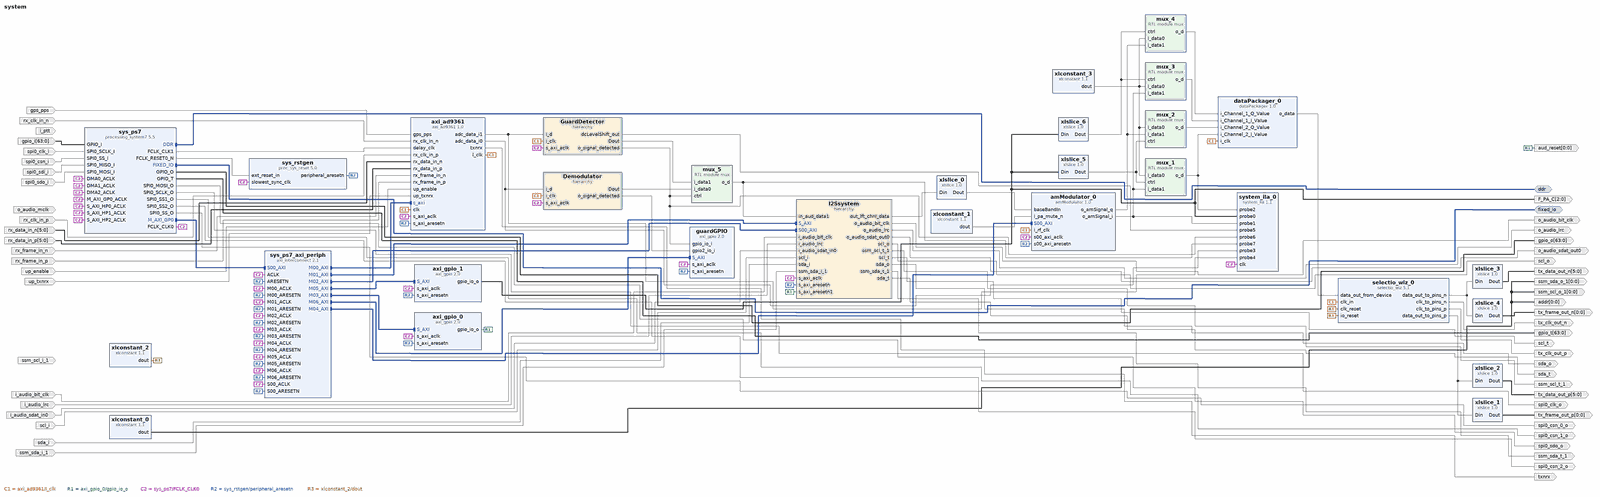
[diagram p0: block diagram of the top level, whole]
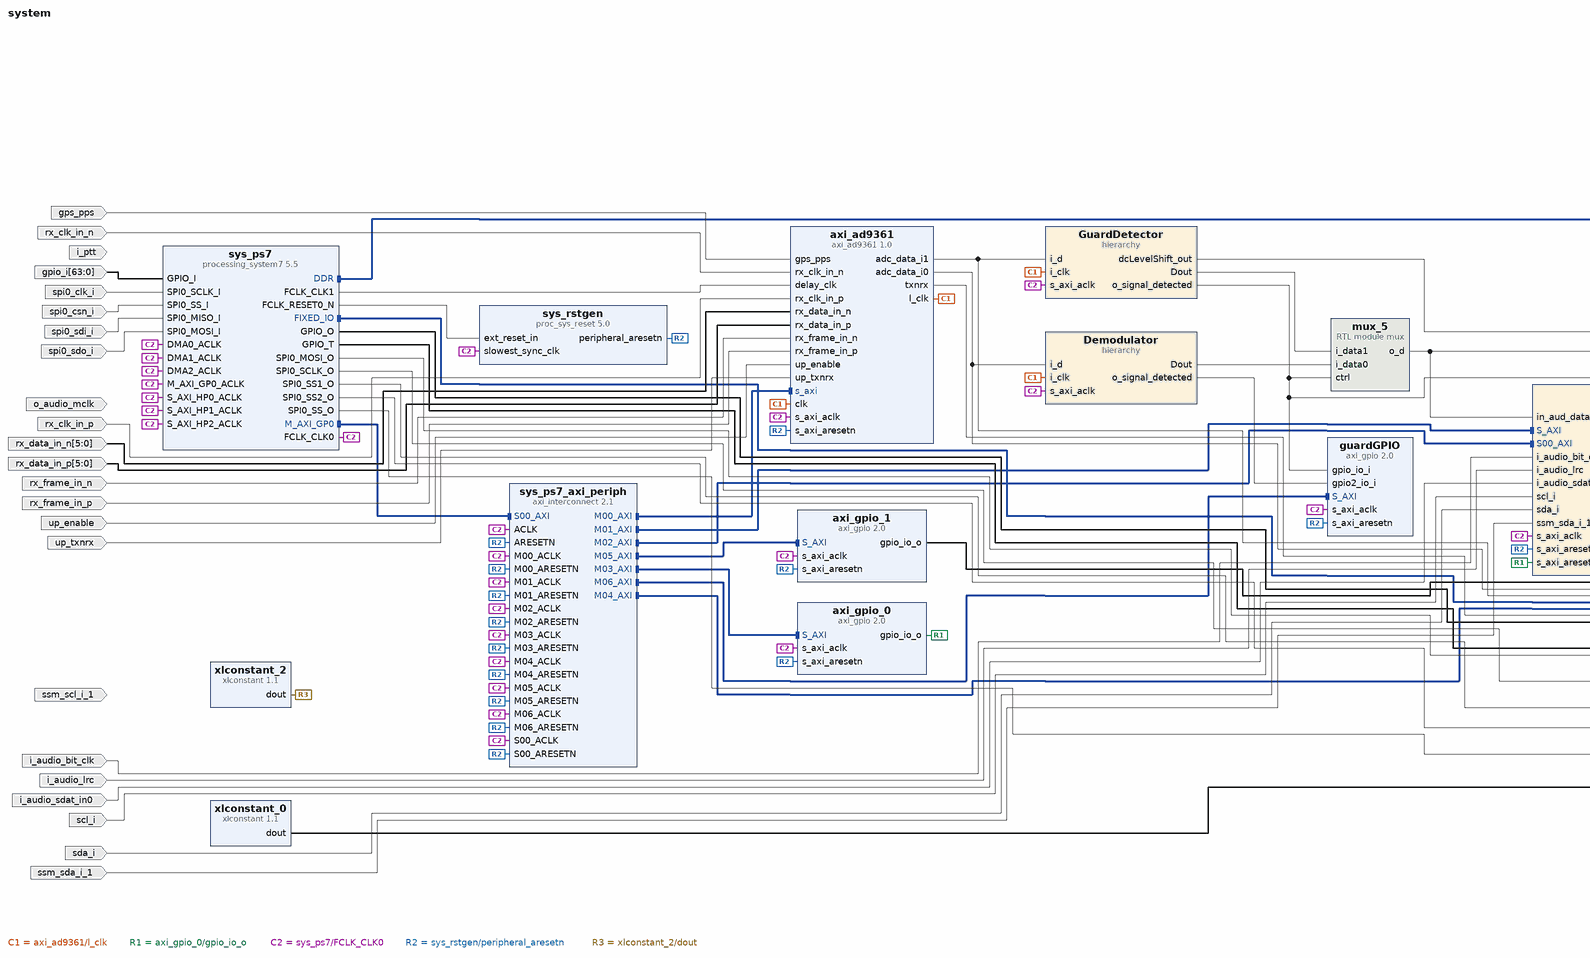
[diagram p1: block diagram of the top level, left part]
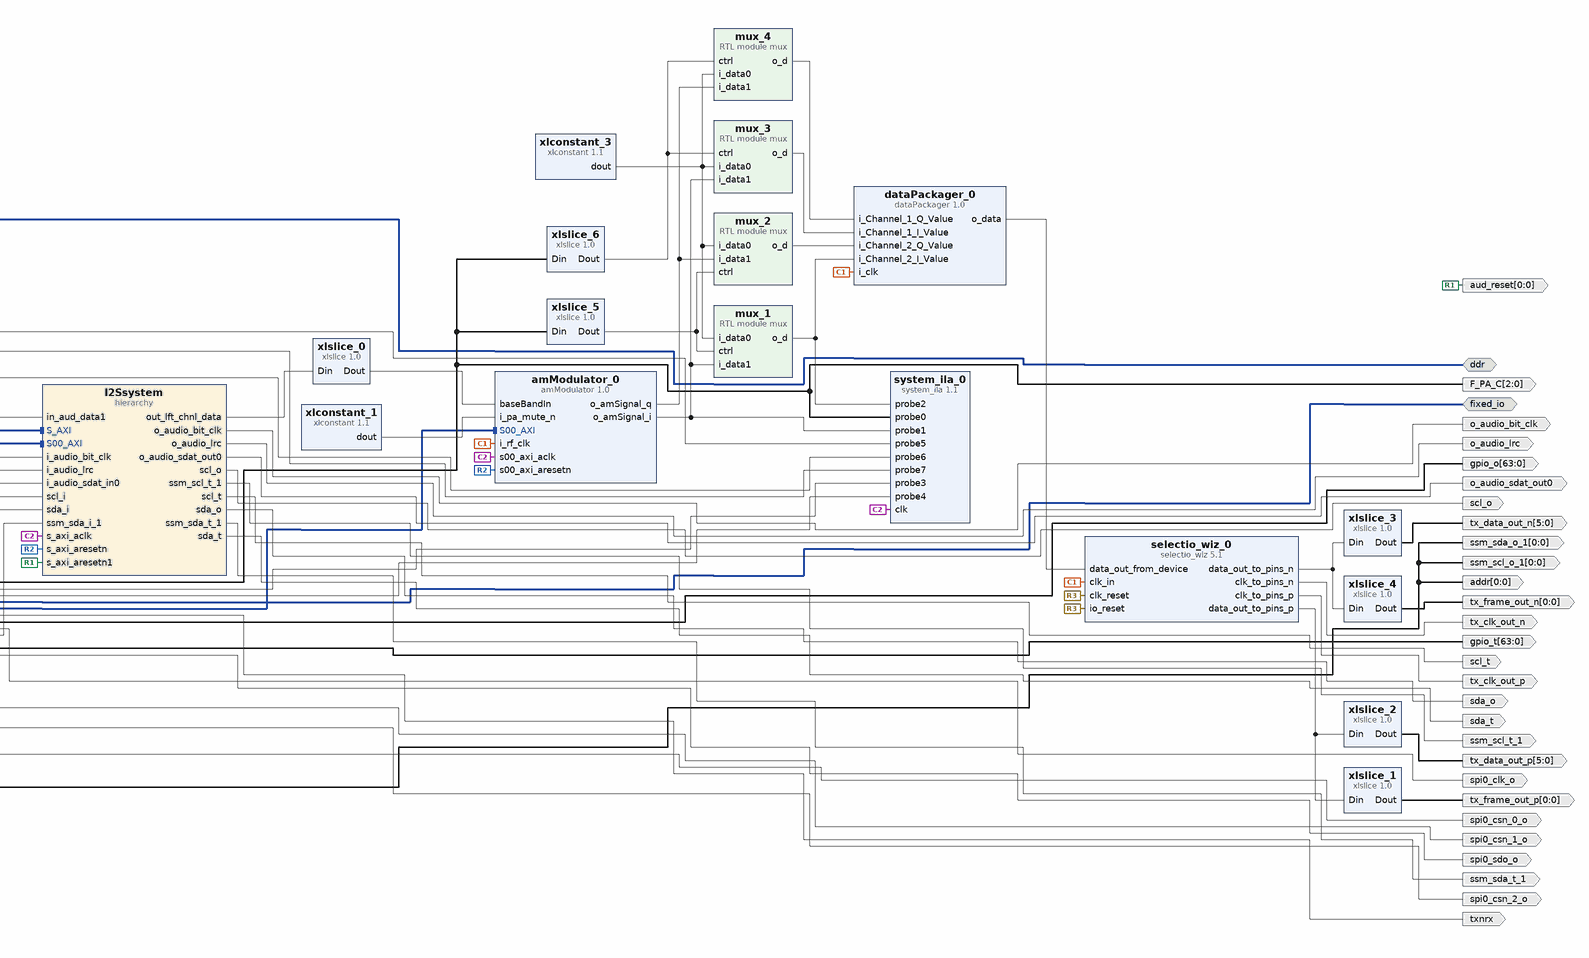
[diagram p2: block diagram of the top level, right part]
# Vivado block design system, xc7z030fbg484-2, Vivado 2021.1
create_bd_design system

create_bd_intf_port -mode Master -vlnv xilinx.com:interface:ddrx_rtl:1.0 ddr
create_bd_intf_port -mode Master -vlnv xilinx.com:display_processing_system7:fixedio_rtl:1.0 fixed_io
create_bd_port -dir O spi0_csn_2_o
create_bd_port -dir O spi0_csn_1_o
create_bd_port -dir O spi0_csn_0_o
create_bd_port -dir I spi0_csn_i
create_bd_port -dir I spi0_clk_i
create_bd_port -dir O spi0_clk_o
create_bd_port -dir I spi0_sdo_i
create_bd_port -dir O spi0_sdo_o
create_bd_port -dir I spi0_sdi_i
create_bd_port -dir I -from 63 -to 0 gpio_i
create_bd_port -dir O -from 63 -to 0 gpio_o
create_bd_port -dir O -from 63 -to 0 gpio_t
create_bd_port -dir O txnrx
create_bd_port -dir I up_enable
create_bd_port -dir I up_txnrx
create_bd_port -dir I gps_pps
create_bd_port -dir I rx_clk_in_p
create_bd_port -dir I rx_clk_in_n
create_bd_port -dir I rx_frame_in_p
create_bd_port -dir I rx_frame_in_n
create_bd_port -dir I -from 5 -to 0 rx_data_in_p
create_bd_port -dir I -from 5 -to 0 rx_data_in_n
create_bd_port -dir O tx_clk_out_p
create_bd_port -dir O tx_clk_out_n
create_bd_port -dir O -from 0 -to 0 tx_frame_out_p
create_bd_port -dir O -from 0 -to 0 tx_frame_out_n
create_bd_port -dir O -from 5 -to 0 tx_data_out_p
create_bd_port -dir O -from 5 -to 0 tx_data_out_n
create_bd_port -dir I scl_i
create_bd_port -dir O scl_o
create_bd_port -dir O scl_t
create_bd_port -dir I sda_i
create_bd_port -dir O sda_o
create_bd_port -dir O sda_t
create_bd_port -dir O -type clk ssm_scl_t_1
create_bd_port -dir O ssm_sda_t_1
create_bd_port -dir O -type clk o_audio_bit_clk
create_bd_port -dir O o_audio_lrc
create_bd_port -dir O o_audio_sdat_out0
create_bd_port -dir I i_audio_sdat_in0
create_bd_port -dir I i_audio_lrc
create_bd_port -dir I -type clk i_audio_bit_clk
set_property -dict {CONFIG.FREQ_HZ 100000000} [get_bd_ports i_audio_bit_clk]
create_bd_port -dir I ssm_sda_i_1
create_bd_port -dir O -from 0 -to 0 ssm_sda_o_1
create_bd_port -dir O -from 0 -to 0 ssm_scl_o_1
create_bd_port -dir O -from 0 -to 0 addr
create_bd_port -dir I o_audio_mclk
create_bd_port -dir I ssm_scl_i_1
create_bd_port -dir O -from 0 -to 0 aud_reset
create_bd_port -dir O -from 2 -to 0 F_PA_C
create_bd_port -dir I i_ptt

create_bd_cell -type ip -vlnv xilinx.com:ip:processing_system7:5.5 sys_ps7
set_property -dict [list \
  CONFIG.PCW_APU_PERIPHERAL_FREQMHZ 666.666666 \
  CONFIG.PCW_CPU_CPU_6X4X_MAX_RANGE 800 \
  CONFIG.PCW_ENET0_PERIPHERAL_ENABLE 0 \
  CONFIG.PCW_ENET1_PERIPHERAL_CLKSRC External \
  CONFIG.PCW_EN_CLK1_PORT 1 \
  CONFIG.PCW_EN_CLK2_PORT 1 \
  CONFIG.PCW_EN_RST1_PORT 1 \
  CONFIG.PCW_EN_RST2_PORT 1 \
  CONFIG.PCW_FCLK_CLK1_BUF TRUE \
  CONFIG.PCW_FCLK_CLK2_BUF TRUE \
  CONFIG.PCW_FPGA0_PERIPHERAL_FREQMHZ 100.0 \
  CONFIG.PCW_FPGA1_PERIPHERAL_FREQMHZ 200.0 \
  CONFIG.PCW_FPGA2_PERIPHERAL_FREQMHZ 200.0 \
  CONFIG.PCW_FPGA_FCLK1_ENABLE 1 \
  CONFIG.PCW_FPGA_FCLK2_ENABLE 1 \
  CONFIG.PCW_GPIO_EMIO_GPIO_ENABLE 1 \
  CONFIG.PCW_GPIO_EMIO_GPIO_IO 64 \
  CONFIG.PCW_GPIO_MIO_GPIO_ENABLE 1 \
  CONFIG.PCW_GPIO_MIO_GPIO_IO MIO \
  CONFIG.PCW_I2C_RESET_ENABLE 0 \
  CONFIG.PCW_IRQ_F2P_INTR 1 \
  CONFIG.PCW_IRQ_F2P_MODE REVERSE \
  CONFIG.PCW_PERIPHERAL_BOARD_PRESET None \
  CONFIG.PCW_PRESET_BANK0_VOLTAGE {LVCMOS 1.8V} \
  CONFIG.PCW_PRESET_BANK1_VOLTAGE {LVCMOS 1.8V} \
  CONFIG.PCW_QSPI_GRP_SINGLE_SS_ENABLE 1 \
  CONFIG.PCW_QSPI_GRP_SINGLE_SS_IO {MIO 1 .. 6} \
  CONFIG.PCW_QSPI_PERIPHERAL_ENABLE 1 \
  CONFIG.PCW_QSPI_QSPI_IO {MIO 1 .. 6} \
  CONFIG.PCW_SD0_PERIPHERAL_ENABLE 0 \
  CONFIG.PCW_SINGLE_QSPI_DATA_MODE x4 \
  CONFIG.PCW_SPI0_PERIPHERAL_ENABLE 1 \
  CONFIG.PCW_SPI0_SPI0_IO EMIO \
  CONFIG.PCW_UART1_PERIPHERAL_ENABLE 0 \
  CONFIG.PCW_UIPARAM_DDR_BUS_WIDTH {16 Bit} \
  CONFIG.PCW_UIPARAM_DDR_FREQ_MHZ 533.333333 \
  CONFIG.PCW_UIPARAM_DDR_PARTNO {MT41K256M16 RE-125} \
  CONFIG.PCW_USB0_PERIPHERAL_ENABLE 0 \
  CONFIG.PCW_USB_RESET_ENABLE 0 \
  CONFIG.PCW_USE_DMA0 1 \
  CONFIG.PCW_USE_DMA1 1 \
  CONFIG.PCW_USE_DMA2 1 \
  CONFIG.PCW_USE_FABRIC_INTERRUPT 1 \
  CONFIG.PCW_USE_S_AXI_HP0 1 \
  CONFIG.PCW_USE_S_AXI_HP1 1 \
  CONFIG.PCW_USE_S_AXI_HP2 1 \
] [get_bd_cells sys_ps7]
# 498 more settings of sys_ps7 are not shown: defaults, MIO pin electricals, DDR timing, and values the tool derives
create_bd_cell -type ip -vlnv xilinx.com:ip:proc_sys_reset:5.0 sys_rstgen
set_property -dict {CONFIG.C_EXT_RST_WIDTH 1} [get_bd_cells sys_rstgen]
create_bd_cell -type ip -vlnv xilinx.com:ip:axi_interconnect:2.1 sys_ps7_axi_periph
set_property -dict {CONFIG.NUM_MI 7} [get_bd_cells sys_ps7_axi_periph]
create_bd_cell -type ip -vlnv xilinx.com:ip:xlconstant:1.1 xlconstant_0
set_property -dict {CONFIG.CONST_VAL 0} [get_bd_cells xlconstant_0]
create_bd_cell -type ip -vlnv xilinx.com:ip:axi_gpio:2.0 axi_gpio_0
set_property -dict {CONFIG.C_ALL_OUTPUTS 1 CONFIG.C_DOUT_DEFAULT 0x00000001 CONFIG.C_GPIO_WIDTH 1} [get_bd_cells axi_gpio_0]
create_bd_cell -type ip -vlnv xilinx.com:ip:xlconstant:1.1 xlconstant_1
create_bd_cell -type ip -vlnv xilinx.com:ip:xlslice:1.0 xlslice_0
set_property -dict {CONFIG.DIN_FROM 29 CONFIG.DIN_TO 18 CONFIG.DIN_WIDTH 31 CONFIG.DOUT_WIDTH 12} [get_bd_cells xlslice_0]
create_bd_cell -type ip -vlnv xilinx.com:ip:selectio_wiz:5.1 selectio_wiz_0
set_property -dict [list \
  CONFIG.BUS_DIR OUTPUTS \
  CONFIG.BUS_IO_STD LVDS \
  CONFIG.BUS_SIG_TYPE DIFF \
  CONFIG.CLK_FWD true \
  CONFIG.CLK_FWD_IO_STD LVDS \
  CONFIG.CLK_FWD_SIG_TYPE DIFF \
  CONFIG.CONFIG_CLK_FWD true \
  CONFIG.SELIO_ACTIVE_EDGE DDR \
  CONFIG.SELIO_BUS_IN_DELAY NONE \
  CONFIG.SELIO_CLK_BUF MMCM \
  CONFIG.SELIO_CLK_IO_STD LVDS \
  CONFIG.SELIO_CLK_SIG_TYPE DIFF \
  CONFIG.SELIO_INTERFACE_TYPE NETWORKING \
  CONFIG.SERIALIZATION_FACTOR 4 \
  CONFIG.SYSTEM_DATA_WIDTH 7 \
] [get_bd_cells selectio_wiz_0]
create_bd_cell -type ip -vlnv xilinx.com:ip:xlconstant:1.1 xlconstant_2
set_property -dict {CONFIG.CONST_VAL 0} [get_bd_cells xlconstant_2]
create_bd_cell -type ip -vlnv xilinx.com:ip:xlslice:1.0 xlslice_1
set_property -dict {CONFIG.DIN_WIDTH 7} [get_bd_cells xlslice_1]
create_bd_cell -type ip -vlnv xilinx.com:ip:xlslice:1.0 xlslice_2
set_property -dict {CONFIG.DIN_FROM 6 CONFIG.DIN_TO 1 CONFIG.DIN_WIDTH 7 CONFIG.DOUT_WIDTH 6} [get_bd_cells xlslice_2]
create_bd_cell -type ip -vlnv xilinx.com:ip:xlslice:1.0 xlslice_3
set_property -dict {CONFIG.DIN_FROM 6 CONFIG.DIN_TO 1 CONFIG.DIN_WIDTH 7 CONFIG.DOUT_WIDTH 6} [get_bd_cells xlslice_3]
create_bd_cell -type ip -vlnv xilinx.com:ip:xlslice:1.0 xlslice_4
set_property -dict {CONFIG.DIN_WIDTH 7} [get_bd_cells xlslice_4]
create_bd_cell -type ip -vlnv xilinx.com:ip:axi_gpio:2.0 axi_gpio_1
set_property -dict {CONFIG.C_ALL_OUTPUTS 1 CONFIG.C_DOUT_DEFAULT 0x00000007 CONFIG.C_GPIO_WIDTH 3} [get_bd_cells axi_gpio_1]
create_bd_cell -type module -reference mux mux_1
create_bd_cell -type module -reference mux mux_2
create_bd_cell -type module -reference mux mux_3
create_bd_cell -type module -reference mux mux_4
create_bd_cell -type ip -vlnv xilinx.com:ip:xlconstant:1.1 xlconstant_3
set_property -dict {CONFIG.CONST_VAL 0 CONFIG.CONST_WIDTH 12} [get_bd_cells xlconstant_3]
create_bd_cell -type ip -vlnv xilinx.com:ip:xlslice:1.0 xlslice_5
set_property -dict {CONFIG.DIN_FROM 2 CONFIG.DIN_TO 2 CONFIG.DIN_WIDTH 3 CONFIG.DOUT_WIDTH 1} [get_bd_cells xlslice_5]
create_bd_cell -type ip -vlnv xilinx.com:ip:xlslice:1.0 xlslice_6
set_property -dict {CONFIG.DIN_FROM 1 CONFIG.DIN_TO 1 CONFIG.DIN_WIDTH 3 CONFIG.DOUT_WIDTH 1} [get_bd_cells xlslice_6]
create_bd_cell -type hier Demodulator
create_bd_cell -type module -reference mux mux_5
create_bd_cell -type hier I2Ssystem
create_bd_cell -type ip -vlnv xilinx.com:ip:system_ila:1.1 system_ila_0
set_property -dict [list \
  CONFIG.C_DATA_DEPTH 65536 \
  CONFIG.C_MON_TYPE NATIVE \
  CONFIG.C_NUM_OF_PROBES 8 \
  CONFIG.C_PROBE0_TYPE 0 \
] [get_bd_cells system_ila_0]
create_bd_cell -type hier GuardDetector
create_bd_cell -type ip -vlnv xilinx.com:ip:axi_gpio:2.0 guardGPIO
set_property -dict [list \
  CONFIG.C_ALL_INPUTS 1 \
  CONFIG.C_ALL_INPUTS_2 1 \
  CONFIG.C_GPIO2_WIDTH 1 \
  CONFIG.C_GPIO_WIDTH 1 \
  CONFIG.C_IS_DUAL 1 \
] [get_bd_cells guardGPIO]
create_bd_cell -type ip -vlnv analog.com:user:axi_ad9361:1.0 axi_ad9361
set_property -dict [list \
  CONFIG.ADC_DATAFORMAT_DISABLE 0 \
  CONFIG.ADC_DATAPATH_DISABLE 0 \
  CONFIG.ADC_DCFILTER_DISABLE 0 \
  CONFIG.ADC_INIT_DELAY 29 \
  CONFIG.ADC_IQCORRECTION_DISABLE 0 \
  CONFIG.ADC_USERPORTS_DISABLE 0 \
  CONFIG.CMOS_OR_LVDS_N 0 \
  CONFIG.DAC_DATAPATH_DISABLE 0 \
  CONFIG.DAC_DDS_DISABLE 0 \
  CONFIG.DAC_IODELAY_ENABLE 1 \
  CONFIG.DAC_IQCORRECTION_DISABLE 0 \
  CONFIG.DAC_USERPORTS_DISABLE 0 \
  CONFIG.DEV_PACKAGE 4 \
  CONFIG.FPGA_FAMILY 4 \
  CONFIG.FPGA_TECHNOLOGY 1 \
  CONFIG.ID 0 \
  CONFIG.MODE_1R1T 0 \
  CONFIG.SPEED_GRADE 21 \
  CONFIG.TDD_DISABLE 0 \
] [get_bd_cells axi_ad9361]
create_bd_cell -type ip -vlnv xilinx.com:user:dataPackager:1.0 dataPackager_0
create_bd_cell -type ip -vlnv xilinx.com:user:amModulator:1.0 amModulator_0

# ---- hierarchy /Demodulator ----
current_bd_instance /Demodulator
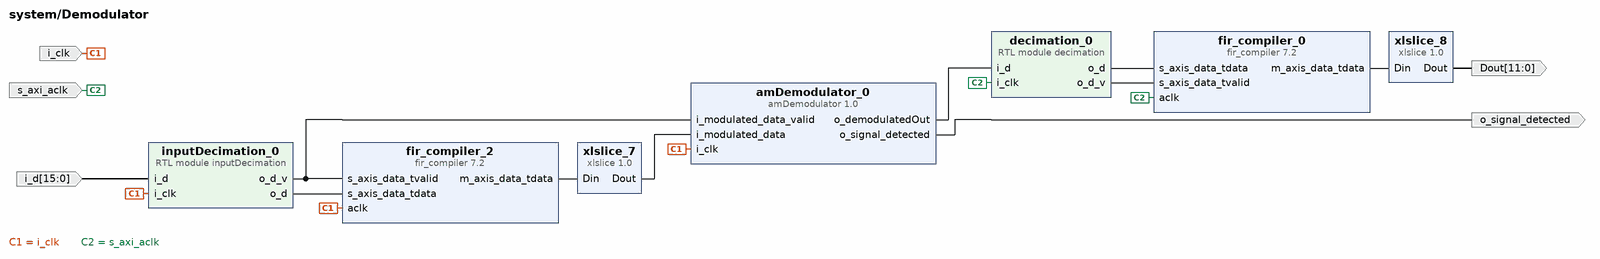
[diagram p3: block diagram inside /Demodulator]
create_bd_pin -dir I -type clk s_axi_aclk
create_bd_pin -dir I -type clk i_clk
create_bd_pin -dir O -from 11 -to 0 Dout
create_bd_pin -dir I -from 15 -to 0 i_d
create_bd_pin -dir O o_signal_detected

create_bd_cell -type ip -vlnv xilinx.com:ip:fir_compiler:7.2 fir_compiler_0
set_property -dict [list \
  CONFIG.BestPrecision true \
  CONFIG.Clock_Frequency 100 \
  CONFIG.CoefficientVector 4.97857463989629e-05,-9.66186716768311e-05,-0.000285972693276480,-0.000638033059764221,-0.00118922643832491,-0.00196250311844038,-0.00295189527080732,-0.00411069959506877,-0.00534467765861517,-0.00651246591908960,-0.00743545387545380,-0.00791730638070645,-0.00777252485882118,-0.00686079086122265,-0.00512249591113992,-0.00260870103501410,0.000500343769484166,0.00389440724056693,0.00715402352601513,0.00979395431763195,0.0113255078683568,0.0113327722797372,0.00955141668320275,0.00593840384848782,0.000720974159454840,-0.00558741726177260,-0.0122098462375855,-0.0181706817624835,-0.0223972169879857,-0.0238486887587461,-0.0216567072141399,-0.0152586643030505,-0.00450455913284762,0.0102798010092384,0.0282855411136966,0.0482744206888967,0.0686901496345555,0.0878159846963768,0.103959968995451,0.115644736336165,0.121777428841651,0.121777428841651,0.115644736336165,0.103959968995451,0.0878159846963768,0.0686901496345555,0.0482744206888967,0.0282855411136966,0.0102798010092384,-0.00450455913284762,-0.0152586643030505,-0.0216567072141399,-0.0238486887587461,-0.0223972169879857,-0.0181706817624835,-0.0122098462375855,-0.00558741726177260,0.000720974159454840,0.00593840384848782,0.00955141668320275,0.0113327722797372,0.0113255078683568,0.00979395431763195,0.00715402352601513,0.00389440724056693,0.000500343769484166,-0.00260870103501410,-0.00512249591113992,-0.00686079086122265,-0.00777252485882118,-0.00791730638070645,-0.00743545387545380,-0.00651246591908960,-0.00534467765861517,-0.00411069959506877,-0.00295189527080732,-0.00196250311844038,-0.00118922643832491,-0.000638033059764221,-0.000285972693276480,-9.66186716768311e-05,4.97857463989629e-05 \
  CONFIG.Coefficient_Fractional_Bits 18 \
  CONFIG.Coefficient_Sets 1 \
  CONFIG.Coefficient_Sign Signed \
  CONFIG.Coefficient_Structure Inferred \
  CONFIG.Coefficient_Width 16 \
  CONFIG.ColumnConfig 1 \
  CONFIG.Data_Fractional_Bits 11 \
  CONFIG.Data_Sign Signed \
  CONFIG.Data_Width 12 \
  CONFIG.Filter_Architecture Systolic_Multiply_Accumulate \
  CONFIG.Output_Rounding_Mode Full_Precision \
  CONFIG.Output_Width 31 \
  CONFIG.Quantization Quantize_Only \
  CONFIG.Sample_Frequency 0.096 \
] [get_bd_cells fir_compiler_0]
create_bd_cell -type module -reference decimation decimation_0
create_bd_cell -type ip -vlnv xilinx.com:ip:xlslice:1.0 xlslice_8
set_property -dict {CONFIG.DIN_FROM 27 CONFIG.DIN_TO 16 CONFIG.DOUT_WIDTH 12} [get_bd_cells xlslice_8]
create_bd_cell -type module -reference inputDecimation inputDecimation_0
create_bd_cell -type ip -vlnv xilinx.com:ip:fir_compiler:7.2 fir_compiler_2
set_property -dict [list \
  CONFIG.BestPrecision true \
  CONFIG.Clock_Frequency 122.88 \
  CONFIG.CoefficientVector -6.65717824104794e-08,-8.40084430198137e-07,-1.38514866711732e-06,-1.37405177205697e-06,-6.88374058663975e-07,4.76269931107288e-07,1.64552303735921e-06,2.24999156445495e-06,1.89093484334086e-06,5.68176494732868e-07,-1.25053006302466e-06,-2.77944411815861e-06,-3.24495271410942e-06,-2.26131113400440e-06,-7.49278695434228e-08,2.46094730074870e-06,4.20698414252423e-06,4.23972353287156e-06,2.31760893599737e-06,-9.16684946330828e-07,-4.12733635296578e-06,-5.82717174015269e-06,-5.05517440273163e-06,-1.88536592133350e-06,2.49161740375249e-06,6.19939479482310e-06,7.47196281604983e-06,5.48096593144154e-06,8.11611305229863e-07,-4.66869629508347e-06,-8.54621002589284e-06,-8.91677564662701e-06,-5.30286045186521e-06,1.00364065658267e-06,7.38009348807228e-06,1.09571381478498e-05,9.90323259873439e-06,4.33717514626359e-06,-3.57748383073946e-06,-1.04606777721478e-05,-1.31563731825375e-05,-1.01729051988305e-05,-2.46811051889197e-06,6.82116944099082e-06,1.36511539549291e-05,1.48317097685637e-05,9.50879583506102e-06,-3.17633092617996e-07,-1.05293957134188e-05,-1.66174020945625e-05,-1.56757724142937e-05,-7.77937984293242e-06,3.90519357228226e-06,1.43861655257833e-05,1.89862706096161e-05,1.54356267586924e-05,4.97860797095516e-06,-8.04085413348283e-06,-1.79897160634318e-05,-2.03954863962918e-05,-1.39645560475086e-05,-1.25463903457055e-06,1.23411094905505e-05,2.08964759981552e-05,2.05526587627356e-05,1.12682525178733e-05,-3.07953191128225e-06,-1.63240852028175e-05,-2.26810096831182e-05,-1.92959754147367e-05,-7.53707750937422e-06,7.55885393362870e-06,1.94629163009714e-05,2.30058542729539e-05,1.66475368839934e-05,3.15663315565558e-06,-1.16050957065376e-05,-2.12572401568666e-05,-2.16925039664346e-05,-1.28497234267401e-05,1.30923309147884e-06,1.45910200117298e-05,2.13154946371854e-05,1.87830149409221e-05,8.37579872829020e-06,-5.16577710584513e-06,-1.59250998887660e-05,-1.94377572998068e-05,-1.45812046192093e-05,-3.90822582798848e-06,7.66380797638159e-06,1.51480967668642e-05,1.56869392338978e-05,9.66347974875833e-06,2.81797090924193e-07,-8.09945517165738e-06,-1.20295275153314e-05,-1.04357079863106e-05,-4.85203969723751e-06,1.60666061207546e-06,5.92703481238506e-06,6.64996818476759e-06,4.37785596347100e-06,1.14742464221302e-06,-9.15074694893230e-07,-8.71126202105394e-07,5.45228789456718e-07,1.50396513536183e-06,3.77268751228582e-07,-3.01252680231204e-06,-6.97828510823659e-06,-8.73357243552104e-06,-6.01733500348824e-06,1.28769911508434e-06,1.05161400780854e-05,1.71040382610309e-05,1.67534436854212e-05,7.88304672070390e-06,-6.93651432459189e-06,-2.15098634569738e-05,-2.85478426305656e-05,-2.31958693960968e-05,-5.89237405299731e-06,1.69977406093322e-05,3.54106285456903e-05,3.99542231489444e-05,2.65464688692131e-05,-9.17335665734032e-07,-3.14074667207604e-05,-5.11219067962928e-05,-4.96760073958791e-05,-2.53664300588944e-05,1.30897954252055e-05,4.95268968191969e-05,6.70836932637349e-05,5.59370652776098e-05,1.84942273023897e-05,-3.06036265823458e-05,-7.01228214344353e-05,-8.13927258443037e-05,-5.70394847819437e-05,-5.24410748884591e-06,5.27769675807782e-05,9.14236580556519e-05,9.19879188985470e-05,5.15943409055006e-05,-1.44258580641078e-05,-7.82436568975682e-05,-0.000111255417766919,-9.68863825919192e-05,-3.87488658574677e-05,3.98033436527345e-05,0.000105015261550418,0.000127251820141239,9.44463933288813e-05,1.83792600718744e-05,-6.93924405222430e-05,-0.000130633806687842,-0.000137121977130572,-8.36265870120579e-05,8.78153637358023e-06,0.000100981505339284,0.000152408658517466,0.000138948972785870,6.42066875340833e-05,-4.11075789023475e-05,-0.000131813663589241,-0.000167718894232920,-0.000131484737075131,-3.69352132999152e-05,7.61532931593650e-05,0.000158852651289939,0.000174351191778333,0.000114402201660531,3.57435063533066e-06,-0.000110842738096338,-0.000179123109475533,-0.000170834407900016,-8.84658852260739e-05,3.31784826073503e-05,0.000141766690700358,0.000190091807847371,0.000156727081537901,5.55873587325162e-05,-6.98995810979918e-05,-0.000165564322696505,-0.000190046361253923,-0.000132814260254273,-1.87424462421441e-05,0.000102769627023278,0.000179352121847223,0.000178422469646312,0.000101175926646384,-1.82581970267900e-05,-0.000128000407865129,-0.000181151624223539,-0.000156030836644969,-6.51008474983255e-05,5.11357083315084e-05,0.000142316136187250,0.000170261296619907,0.000125141391795383,2.88360777677633e-05,-7.56185960242030e-05,-0.000143435532024902,-0.000147517949594997,-8.93951961348569e-05,2.81791067178870e-06,8.79814701257601e-05,0.000130493801282124,0.000115400129709980,5.35325624138316e-05,-2.50355887680481e-05,-8.55872571599403e-05,-0.000104343543286184,-7.79399683690437e-05,-2.29477785277108e-05,3.35677886055461e-05,6.73652839881328e-05,6.76812861620625e-05,4.04299799488858e-05,3.10401946849886e-06,-2.53502501772250e-05,-3.41573022940714e-05,-2.49617134852225e-05,-8.93544655734831e-06,1.13623895515408e-06,-9.55637854568532e-07,-1.11282221338091e-05,-1.79163531251755e-05,-1.03512961852361e-05,1.38073309382812e-05,4.45654495916407e-05,6.35964740210373e-05,5.41415441034193e-05,1.18542316395530e-05,-4.96224477047485e-05,-0.000102384414070338,-0.000116700116250370,-7.67000638771385e-05,8.62509688699859e-06,0.000105648610743057,0.000169078717648198,0.000162816140364655,7.91985494005273e-05,-5.32198652643821e-05,-0.000178650856565221,-0.000237427606869937,-0.000194024014081939,-5.67122701499517e-05,0.000121476689665273,0.000262877714783670,0.000298946404559644,0.000203013771047471,6.55809817977268e-06,-0.000210083884266892,-0.000350429509744729,-0.000344736114763617,-0.000184028592878151,7.11105179187439e-05,0.000312911154957450,0.000431928058210661,0.000366482525076913,0.000133731463433838,-0.000172979102265679,-0.000421391478426738,-0.000497440978569880,-0.000357500858207739,-5.18824561732703e-05,0.000292588025318534,0.000525237609754051,0.000537577640540187,0.000313705019911896,-5.82762217594771e-05,-0.000420724782432514,-0.000613444171904880,-0.000544643876990621,-0.000234376459257238,0.000190006046087823,0.000546187046676307,0.000675486375411775,0.000513723273047392,0.000122618432959847,-0.000333471079338770,-0.000656865453866120,-0.000702593145233465,-0.000443547589144172,1.45927583320065e-05,0.000476546878719186,0.000741051136705193,0.000688950527997110,0.000337029726885927,-0.000166808845024740,-0.000605986715668066,-0.000788836051115956,-0.000632684521473599,-0.000201359902642199,0.000320963157278829,0.000708844102371669,0.000793449310537325,0.000536483231031481,4.76076750331802e-05,-0.000462622780133787,-0.000774009579235497,-0.000752364260926614,-0.000407746931590139,0.000110174449387738,0.000577532350624523,0.000793691607446658,0.000668021504173357,0.000258199483538936,-0.000256291247887533,-0.000653297051309665,-0.000764660860653929,-0.000548043077943646,-0.000102951785509134,0.000375076133836210,0.000681020568106071,0.000689087161267526,0.000404860793238627,-4.09281294254854e-05,-0.000452730531023355,-0.000656700807702055,-0.000574829508953157,-0.000254743289135139,0.000156220132420803,0.000479132276807034,0.000582195320796453,0.000435090373705674,0.000116275645987210,-0.000227558239229220,-0.000449398266548930,-0.000465600617722628,-0.000287411459642744,-8.41489842764489e-06,0.000243423645002174,0.000364994578868910,0.000320943195826016,0.000152063077962114,-5.16936904841410e-05,-0.000197891083280933,-0.000234220391700926,-0.000167150738346070,-4.99550681042306e-05,5.09091660728968e-05,9.19015668818731e-05,7.19484783702092e-05,2.63528134352055e-05,2.65042434889690e-07,1.79570285047283e-05,6.61317903227461e-05,0.000101419575826608,7.83570707615831e-05,-1.80309458181836e-05,-0.000154686072711445,-0.000260518952913160,-0.000261738216020896,-0.000125491510346118,0.000111982074292630,0.000350904667330005,0.000469343094598634,0.000383507911632134,9.78073363466771e-05,-0.000282880530815681,-0.000590198781965125,-0.000666326082226924,-0.000442653290017523,1.52842718053588e-05,0.000522611334004169,0.000849156281209349,0.000823372433739986,0.000419408028298799,-0.000215832625614769,-0.000814195243162358,-0.00109930621369325,-0.000913564763938051,-0.000300987412881478,0.000496251086916371,0.00113280863979127,0.00130981724224984,0.000914311763855076,8.37249987147033e-05,-0.000839206906094610,-0.00144778766847683,-0.00145071897728199,-0.000810305684098475,0.000225618173229308,0.00121860048416369,0.00172548009371488,0.00149632966713942,0.000595937436364377,-0.000609595464183648,-0.00160162303028325,-0.00193270038397414,-0.00142852243799850,-0.000276847665825758,0.00104099236329951,0.00195175900944772,0.00204045410144094,0.00123944821504437,-0.000129638794867401,-0.00148492349318476,-0.00223248197771700,-0.00202753833784455,-0.000933361152366748,0.000595344498242419,0.00190198058096565,0.00241129302465472,0.00188360474733680,0.000527262031436083,-0.00108335798755892,-0.00225217481812519,-0.00246368266730580,-0.00161129600551201,-5.01821319797484e-05,0.00155131921541071,0.00249930686377899,0.00237656969596079,0.00122713599121563,-0.000458934514483184,-0.00195561224273176,-0.00261531930876093,-0.00215079032886097,-0.000760964371910278,0.000954641675498064,0.00225608386908749,0.00258415079134963,0.00180227944757243,0.000253848446889024,-0.00138943456177243,-0.00242081726755894,-0.00240462525162390,-0.00136169872791840,0.000245434220346154,0.00171883254146951,0.00243044456336481,0.00209197612225526,0.000872415028881360,-0.000685085908463193,-0.00190660506817279,-0.00228148975276247,-0.00167772009524850,-0.000386902811068925,0.00101574749252148,0.00192958901225371,0.00198829634173963,0.00120774944913572,-3.81803138987222e-05,-0.00119620653617296,-0.00178154479065181,-0.00158320966533237,-0.000738691847048270,0.000347834133493539,0.00119876725784543,0.00147555694218734,0.00111484320362164,0.000332774433257791,-0.000494931997309290,-0.00101368432193689,-0.00104459984403590,-0.000644447229779544,-5.16054074956738e-05,0.000446190328733684,0.000652114346850636,0.000540052607644954,0.000240598639756582,-5.05684718964972e-05,-0.000187247202410365,-0.000147152042536511,-2.81446397212259e-05,2.73776705796048e-05,-6.65268262720114e-05,-0.000273750413274804,-0.000447316058013642,-0.000415473756180106,-9.66837339125652e-05,0.000423402984578360,0.000904541873946578,0.00106000237195833,0.000712634401929347,-8.16656777200353e-05,-0.00101649790278006,-0.00164945444789508,-0.00160769087137274,-0.000790447464994264,0.000536281859980038,0.00181589537375250,0.00243252399657019,0.00200240641544754,0.000589279429368086,-0.00127027912850995,-0.00276546223171023,-0.00316291161818140,-0.00215969871802879,-7.01346502923283e-05,0.00225820763872398,0.00378557344359359,0.00374225549748871,0.00200730894538751,-0.000779329731045449,-0.00344549596528203,-0.00477834983150596,-0.00407338200149665,-0.00149340191737290,0.00194083999871496,0.00475063861078194,0.00563508090813169,0.00406963032715518,0.000593538717738044,-0.00336411889764279,-0.00607010940218110,-0.00624527189749492,-0.00366394017155449,0.000684362183426963,0.00496838181692573,0.00728571595053968,0.00650656381570784,0.00281682559679837,-0.00229767595444388,-0.00664676167740016,-0.00827385912135464,-0.00633464954601416,-0.00152241670766317,0.00416971766638403,0.00827343012609995,0.00891595050712083,0.00567226253053946,-0.000188108196933946,-0.00619350179590919,-0.00971291439997855,-0.00910909285410407,-0.00449635592520515,0.00224616427767659,0.00823844465982966,0.0108308776211010,0.00877606040730429,0.00282271819992176,-0.00454867302977776,-0.0101595554757700,-0.0115054595200132,-0.00787363789420333,-0.000707476844333216,0.00696414735965296,0.0118084100652593,0.0116381835603566,0.00639848940050335,-0.00175479236554082,-0.00934155179603607,-0.0130450075292053,-0.0111634366966502,-0.00438992371370993,0.00443633111366356,0.0115212700624241,0.0137494951884091,0.0100556223402704,0.00192918438605294,-0.00718450993543037,-0.0133472959174304,-0.0138327241176911,-0.00833326909365464,0.000864802641199114,0.00983256769733213,0.0146796235909536,0.0132446713757761,0.00605963218657291,-0.00384297174244425,-0.0122119234554723,-0.0154057666213878,-0.0119799307891442,-0.00333962859281000,0.00683639488778427,0.0141650408402512,0.0154503850256253,0.0100797180030047,0.000313272471714427,-0.00966847908853835,-0.0155577521604479,-0.0147821475633863,-0.00763013568266466,0.00285390579902660,0.0121680814065672,0.0162899762136765,0.0134171860465934,0.00475677360178367,-0.00598269641694953,-0.0141824401873798,-0.0163038892913506,-0.0114187915505624,-0.00161604508389395,0.00889333102012557,0.0155888224208192,0.0155888224208192,0.00889333102012557,-0.00161604508389395,-0.0114187915505624,-0.0163038892913506,-0.0141824401873798,-0.00598269641694953,0.00475677360178367,0.0134171860465934,0.0162899762136765,0.0121680814065672,0.00285390579902660,-0.00763013568266466,-0.0147821475633863,-0.0155577521604479,-0.00966847908853835,0.000313272471714427,0.0100797180030047,0.0154503850256253,0.0141650408402512,0.00683639488778427,-0.00333962859281000,-0.0119799307891442,-0.0154057666213878,-0.0122119234554723,-0.00384297174244425,0.00605963218657291,0.0132446713757761,0.0146796235909536,0.00983256769733213,0.000864802641199114,-0.00833326909365464,-0.0138327241176911,-0.0133472959174304,-0.00718450993543037,0.00192918438605294,0.0100556223402704,0.0137494951884091,0.0115212700624241,0.00443633111366356,-0.00438992371370993,-0.0111634366966502,-0.0130450075292053,-0.00934155179603607,-0.00175479236554082,0.00639848940050335,0.0116381835603566,0.0118084100652593,0.00696414735965296,-0.000707476844333216,-0.00787363789420333,-0.0115054595200132,-0.0101595554757700,-0.00454867302977776,0.00282271819992176,0.00877606040730429,0.0108308776211010,0.00823844465982966,0.00224616427767659,-0.00449635592520515,-0.00910909285410407,-0.00971291439997855,-0.00619350179590919,-0.000188108196933946,0.00567226253053946,0.00891595050712083,0.00827343012609995,0.00416971766638403,-0.00152241670766317,-0.00633464954601416,-0.00827385912135464,-0.00664676167740016,-0.00229767595444388,0.00281682559679837,0.00650656381570784,0.00728571595053968,0.00496838181692573,0.000684362183426963,-0.00366394017155449,-0.00624527189749492,-0.00607010940218110,-0.00336411889764279,0.000593538717738044,0.00406963032715518,0.00563508090813169,0.00475063861078194,0.00194083999871496,-0.00149340191737290,-0.00407338200149665,-0.00477834983150596,-0.00344549596528203,-0.000779329731045449,0.00200730894538751,0.00374225549748871,0.00378557344359359,0.00225820763872398,-7.01346502923283e-05,-0.00215969871802879,-0.00316291161818140,-0.00276546223171023,-0.00127027912850995,0.000589279429368086,0.00200240641544754,0.00243252399657019,0.00181589537375250,0.000536281859980038,-0.000790447464994264,-0.00160769087137274,-0.00164945444789508,-0.00101649790278006,-8.16656777200353e-05,0.000712634401929347,0.00106000237195833,0.000904541873946578,0.000423402984578360,-9.66837339125652e-05,-0.000415473756180106,-0.000447316058013642,-0.000273750413274804,-6.65268262720114e-05,2.73776705796048e-05,-2.81446397212259e-05,-0.000147152042536511,-0.000187247202410365,-5.05684718964972e-05,0.000240598639756582,0.000540052607644954,0.000652114346850636,0.000446190328733684,-5.16054074956738e-05,-0.000644447229779544,-0.00104459984403590,-0.00101368432193689,-0.000494931997309290,0.000332774433257791,0.00111484320362164,0.00147555694218734,0.00119876725784543,0.000347834133493539,-0.000738691847048270,-0.00158320966533237,-0.00178154479065181,-0.00119620653617296,-3.81803138987222e-05,0.00120774944913572,0.00198829634173963,0.00192958901225371,0.00101574749252148,-0.000386902811068925,-0.00167772009524850,-0.00228148975276247,-0.00190660506817279,-0.000685085908463193,0.000872415028881360,0.00209197612225526,0.00243044456336481,0.00171883254146951,0.000245434220346154,-0.00136169872791840,-0.00240462525162390,-0.00242081726755894,-0.00138943456177243,0.000253848446889024,0.00180227944757243,0.00258415079134963,0.00225608386908749,0.000954641675498064,-0.000760964371910278,-0.00215079032886097,-0.00261531930876093,-0.00195561224273176,-0.000458934514483184,0.00122713599121563,0.00237656969596079,0.00249930686377899,0.00155131921541071,-5.01821319797484e-05,-0.00161129600551201,-0.00246368266730580,-0.00225217481812519,-0.00108335798755892,0.000527262031436083,0.00188360474733680,0.00241129302465472,0.00190198058096565,0.000595344498242419,-0.000933361152366748,-0.00202753833784455,-0.00223248197771700,-0.00148492349318476,-0.000129638794867401,0.00123944821504437,0.00204045410144094,0.00195175900944772,0.00104099236329951,-0.000276847665825758,-0.00142852243799850,-0.00193270038397414,-0.00160162303028325,-0.000609595464183648,0.000595937436364377,0.00149632966713942,0.00172548009371488,0.00121860048416369,0.000225618173229308,-0.000810305684098475,-0.00145071897728199,-0.00144778766847683,-0.000839206906094610,8.37249987147033e-05,0.000914311763855076,0.00130981724224984,0.00113280863979127,0.000496251086916371,-0.000300987412881478,-0.000913564763938051,-0.00109930621369325,-0.000814195243162358,-0.000215832625614769,0.000419408028298799,0.000823372433739986,0.000849156281209349,0.000522611334004169,1.52842718053588e-05,-0.000442653290017523,-0.000666326082226924,-0.000590198781965125,-0.000282880530815681,9.78073363466771e-05,0.000383507911632134,0.000469343094598634,0.000350904667330005,0.000111982074292630,-0.000125491510346118,-0.000261738216020896,-0.000260518952913160,-0.000154686072711445,-1.80309458181836e-05,7.83570707615831e-05,0.000101419575826608,6.61317903227461e-05,1.79570285047283e-05,2.65042434889690e-07,2.63528134352055e-05,7.19484783702092e-05,9.19015668818731e-05,5.09091660728968e-05,-4.99550681042306e-05,-0.000167150738346070,-0.000234220391700926,-0.000197891083280933,-5.16936904841410e-05,0.000152063077962114,0.000320943195826016,0.000364994578868910,0.000243423645002174,-8.41489842764489e-06,-0.000287411459642744,-0.000465600617722628,-0.000449398266548930,-0.000227558239229220,0.000116275645987210,0.000435090373705674,0.000582195320796453,0.000479132276807034,0.000156220132420803,-0.000254743289135139,-0.000574829508953157,-0.000656700807702055,-0.000452730531023355,-4.09281294254854e-05,0.000404860793238627,0.000689087161267526,0.000681020568106071,0.000375076133836210,-0.000102951785509134,-0.000548043077943646,-0.000764660860653929,-0.000653297051309665,-0.000256291247887533,0.000258199483538936,0.000668021504173357,0.000793691607446658,0.000577532350624523,0.000110174449387738,-0.000407746931590139,-0.000752364260926614,-0.000774009579235497,-0.000462622780133787,4.76076750331802e-05,0.000536483231031481,0.000793449310537325,0.000708844102371669,0.000320963157278829,-0.000201359902642199,-0.000632684521473599,-0.000788836051115956,-0.000605986715668066,-0.000166808845024740,0.000337029726885927,0.000688950527997110,0.000741051136705193,0.000476546878719186,1.45927583320065e-05,-0.000443547589144172,-0.000702593145233465,-0.000656865453866120,-0.000333471079338770,0.000122618432959847,0.000513723273047392,0.000675486375411775,0.000546187046676307,0.000190006046087823,-0.000234376459257238,-0.000544643876990621,-0.000613444171904880,-0.000420724782432514,-5.82762217594771e-05,0.000313705019911896,0.000537577640540187,0.000525237609754051,0.000292588025318534,-5.18824561732703e-05,-0.000357500858207739,-0.000497440978569880,-0.000421391478426738,-0.000172979102265679,0.000133731463433838,0.000366482525076913,0.000431928058210661,0.000312911154957450,7.11105179187439e-05,-0.000184028592878151,-0.000344736114763617,-0.000350429509744729,-0.000210083884266892,6.55809817977268e-06,0.000203013771047471,0.000298946404559644,0.000262877714783670,0.000121476689665273,-5.67122701499517e-05,-0.000194024014081939,-0.000237427606869937,-0.000178650856565221,-5.32198652643821e-05,7.91985494005273e-05,0.000162816140364655,0.000169078717648198,0.000105648610743057,8.62509688699859e-06,-7.67000638771385e-05,-0.000116700116250370,-0.000102384414070338,-4.96224477047485e-05,1.18542316395530e-05,5.41415441034193e-05,6.35964740210373e-05,4.45654495916407e-05,1.38073309382812e-05,-1.03512961852361e-05,-1.79163531251755e-05,-1.11282221338091e-05,-9.55637854568532e-07,1.13623895515408e-06,-8.93544655734831e-06,-2.49617134852225e-05,-3.41573022940714e-05,-2.53502501772250e-05,3.10401946849886e-06,4.04299799488858e-05,6.76812861620625e-05,6.73652839881328e-05,3.35677886055461e-05,-2.29477785277108e-05,-7.79399683690437e-05,-0.000104343543286184,-8.55872571599403e-05,-2.50355887680481e-05,5.35325624138316e-05,0.000115400129709980,0.000130493801282124,8.79814701257601e-05,2.81791067178870e-06,-8.93951961348569e-05,-0.000147517949594997,-0.000143435532024902,-7.56185960242030e-05,2.88360777677633e-05,0.000125141391795383,0.000170261296619907,0.000142316136187250,5.11357083315084e-05,-6.51008474983255e-05,-0.000156030836644969,-0.000181151624223539,-0.000128000407865129,-1.82581970267900e-05,0.000101175926646384,0.000178422469646312,0.000179352121847223,0.000102769627023278,-1.87424462421441e-05,-0.000132814260254273,-0.000190046361253923,-0.000165564322696505,-6.98995810979918e-05,5.55873587325162e-05,0.000156727081537901,0.000190091807847371,0.000141766690700358,3.31784826073503e-05,-8.84658852260739e-05,-0.000170834407900016,-0.000179123109475533,-0.000110842738096338,3.57435063533066e-06,0.000114402201660531,0.000174351191778333,0.000158852651289939,7.61532931593650e-05,-3.69352132999152e-05,-0.000131484737075131,-0.000167718894232920,-0.000131813663589241,-4.11075789023475e-05,6.42066875340833e-05,0.000138948972785870,0.000152408658517466,0.000100981505339284,8.78153637358023e-06,-8.36265870120579e-05,-0.000137121977130572,-0.000130633806687842,-6.93924405222430e-05,1.83792600718744e-05,9.44463933288813e-05,0.000127251820141239,0.000105015261550418,3.98033436527345e-05,-3.87488658574677e-05,-9.68863825919192e-05,-0.000111255417766919,-7.82436568975682e-05,-1.44258580641078e-05,5.15943409055006e-05,9.19879188985470e-05,9.14236580556519e-05,5.27769675807782e-05,-5.24410748884591e-06,-5.70394847819437e-05,-8.13927258443037e-05,-7.01228214344353e-05,-3.06036265823458e-05,1.84942273023897e-05,5.59370652776098e-05,6.70836932637349e-05,4.95268968191969e-05,1.30897954252055e-05,-2.53664300588944e-05,-4.96760073958791e-05,-5.11219067962928e-05,-3.14074667207604e-05,-9.17335665734032e-07,2.65464688692131e-05,3.99542231489444e-05,3.54106285456903e-05,1.69977406093322e-05,-5.89237405299731e-06,-2.31958693960968e-05,-2.85478426305656e-05,-2.15098634569738e-05,-6.93651432459189e-06,7.88304672070390e-06,1.67534436854212e-05,1.71040382610309e-05,1.05161400780854e-05,1.28769911508434e-06,-6.01733500348824e-06,-8.73357243552104e-06,-6.97828510823659e-06,-3.01252680231204e-06,3.77268751228582e-07,1.50396513536183e-06,5.45228789456718e-07,-8.71126202105394e-07,-9.15074694893230e-07,1.14742464221302e-06,4.37785596347100e-06,6.64996818476759e-06,5.92703481238506e-06,1.60666061207546e-06,-4.85203969723751e-06,-1.04357079863106e-05,-1.20295275153314e-05,-8.09945517165738e-06,2.81797090924193e-07,9.66347974875833e-06,1.56869392338978e-05,1.51480967668642e-05,7.66380797638159e-06,-3.90822582798848e-06,-1.45812046192093e-05,-1.94377572998068e-05,-1.59250998887660e-05,-5.16577710584513e-06,8.37579872829020e-06,1.87830149409221e-05,2.13154946371854e-05,1.45910200117298e-05,1.30923309147884e-06,-1.28497234267401e-05,-2.16925039664346e-05,-2.12572401568666e-05,-1.16050957065376e-05,3.15663315565558e-06,1.66475368839934e-05,2.30058542729539e-05,1.94629163009714e-05,7.55885393362870e-06,-7.53707750937422e-06,-1.92959754147367e-05,-2.26810096831182e-05,-1.63240852028175e-05,-3.07953191128225e-06,1.12682525178733e-05,2.05526587627356e-05,2.08964759981552e-05,1.23411094905505e-05,-1.25463903457055e-06,-1.39645560475086e-05,-2.03954863962918e-05,-1.79897160634318e-05,-8.04085413348283e-06,4.97860797095516e-06,1.54356267586924e-05,1.89862706096161e-05,1.43861655257833e-05,3.90519357228226e-06,-7.77937984293242e-06,-1.56757724142937e-05,-1.66174020945625e-05,-1.05293957134188e-05,-3.17633092617996e-07,9.50879583506102e-06,1.48317097685637e-05,1.36511539549291e-05,6.82116944099082e-06,-2.46811051889197e-06,-1.01729051988305e-05,-1.31563731825375e-05,-1.04606777721478e-05,-3.57748383073946e-06,4.33717514626359e-06,9.90323259873439e-06,1.09571381478498e-05,7.38009348807228e-06,1.00364065658267e-06,-5.30286045186521e-06,-8.91677564662701e-06,-8.54621002589284e-06,-4.66869629508347e-06,8.11611305229863e-07,5.48096593144154e-06,7.47196281604983e-06,6.19939479482310e-06,2.49161740375249e-06,-1.88536592133350e-06,-5.05517440273163e-06,-5.82717174015269e-06,-4.12733635296578e-06,-9.16684946330828e-07,2.31760893599737e-06,4.23972353287156e-06,4.20698414252423e-06,2.46094730074870e-06,-7.49278695434228e-08,-2.26131113400440e-06,-3.24495271410942e-06,-2.77944411815861e-06,-1.25053006302466e-06,5.68176494732868e-07,1.89093484334086e-06,2.24999156445495e-06,1.64552303735921e-06,4.76269931107288e-07,-6.88374058663975e-07,-1.37405177205697e-06,-1.38514866711732e-06,-8.40084430198137e-07,-6.65717824104794e-08 \
  CONFIG.Coefficient_Fractional_Bits 20 \
  CONFIG.Coefficient_Sets 1 \
  CONFIG.Coefficient_Sign Signed \
  CONFIG.Coefficient_Structure Inferred \
  CONFIG.Coefficient_Width 16 \
  CONFIG.ColumnConfig 10 \
  CONFIG.Data_Fractional_Bits 11 \
  CONFIG.Data_Sign Signed \
  CONFIG.Data_Width 12 \
  CONFIG.Filter_Architecture Systolic_Multiply_Accumulate \
  CONFIG.Output_Rounding_Mode Full_Precision \
  CONFIG.Output_Width 33 \
  CONFIG.Quantization Quantize_Only \
  CONFIG.Sample_Frequency 2 \
] [get_bd_cells fir_compiler_2]
create_bd_cell -type ip -vlnv xilinx.com:ip:xlslice:1.0 xlslice_7
set_property -dict {CONFIG.DIN_FROM 31 CONFIG.DIN_TO 20 CONFIG.DIN_WIDTH 40 CONFIG.DOUT_WIDTH 12} [get_bd_cells xlslice_7]
create_bd_cell -type ip -vlnv xilinx.com:user:amDemodulator:1.0 amDemodulator_0

# ---- hierarchy /I2Ssystem ----
current_bd_instance /I2Ssystem
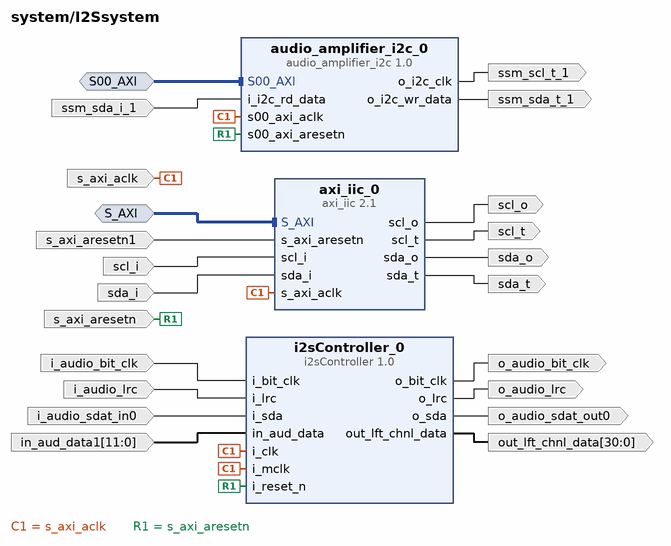
[diagram p4: block diagram inside /I2Ssystem]
create_bd_intf_pin -mode Slave -vlnv xilinx.com:interface:aximm_rtl:1.0 S_AXI
create_bd_intf_pin -mode Slave -vlnv xilinx.com:interface:aximm_rtl:1.0 S00_AXI
create_bd_pin -dir I -type clk s_axi_aclk
create_bd_pin -dir I -type rst s_axi_aresetn
create_bd_pin -dir I sda_i
create_bd_pin -dir O sda_o
create_bd_pin -dir O sda_t
create_bd_pin -dir I scl_i
create_bd_pin -dir O scl_o
create_bd_pin -dir O scl_t
create_bd_pin -dir O -type clk ssm_scl_t_1
create_bd_pin -dir O ssm_sda_t_1
create_bd_pin -dir O -type clk o_audio_bit_clk
create_bd_pin -dir O o_audio_lrc
create_bd_pin -dir O o_audio_sdat_out0
create_bd_pin -dir I i_audio_sdat_in0
create_bd_pin -dir I i_audio_lrc
create_bd_pin -dir I -type clk i_audio_bit_clk
create_bd_pin -dir I ssm_sda_i_1
create_bd_pin -dir I -type rst s_axi_aresetn1
create_bd_pin -dir O -from 30 -to 0 out_lft_chnl_data
create_bd_pin -dir I -from 11 -to 0 in_aud_data1

create_bd_cell -type ip -vlnv xilinx.com:ip:axi_iic:2.1 axi_iic_0
create_bd_cell -type ip -vlnv xilinx.com:user:audio_amplifier_i2c:1.0 audio_amplifier_i2c_0
create_bd_cell -type ip -vlnv xilinx.com:user:i2sController:1.0 i2sController_0

# ---- hierarchy /GuardDetector ----
current_bd_instance /GuardDetector
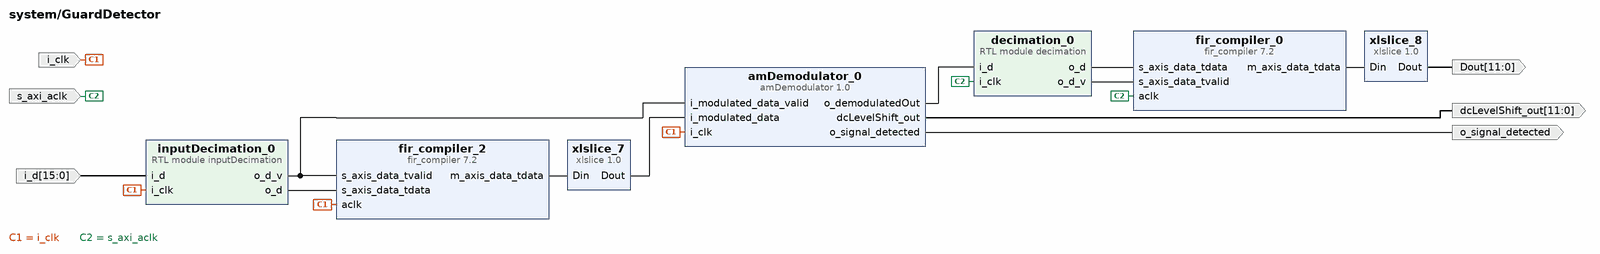
[diagram p5: block diagram inside /GuardDetector]
create_bd_pin -dir I -type clk s_axi_aclk
create_bd_pin -dir I -type clk i_clk
create_bd_pin -dir O -from 11 -to 0 Dout
create_bd_pin -dir I -from 15 -to 0 i_d
create_bd_pin -dir O o_signal_detected
create_bd_pin -dir O -from 11 -to 0 dcLevelShift_out

create_bd_cell -type ip -vlnv xilinx.com:ip:fir_compiler:7.2 fir_compiler_0
set_property -dict [list \
  CONFIG.BestPrecision true \
  CONFIG.Clock_Frequency 100 \
  CONFIG.CoefficientVector 4.97857463989629e-05,-9.66186716768311e-05,-0.000285972693276480,-0.000638033059764221,-0.00118922643832491,-0.00196250311844038,-0.00295189527080732,-0.00411069959506877,-0.00534467765861517,-0.00651246591908960,-0.00743545387545380,-0.00791730638070645,-0.00777252485882118,-0.00686079086122265,-0.00512249591113992,-0.00260870103501410,0.000500343769484166,0.00389440724056693,0.00715402352601513,0.00979395431763195,0.0113255078683568,0.0113327722797372,0.00955141668320275,0.00593840384848782,0.000720974159454840,-0.00558741726177260,-0.0122098462375855,-0.0181706817624835,-0.0223972169879857,-0.0238486887587461,-0.0216567072141399,-0.0152586643030505,-0.00450455913284762,0.0102798010092384,0.0282855411136966,0.0482744206888967,0.0686901496345555,0.0878159846963768,0.103959968995451,0.115644736336165,0.121777428841651,0.121777428841651,0.115644736336165,0.103959968995451,0.0878159846963768,0.0686901496345555,0.0482744206888967,0.0282855411136966,0.0102798010092384,-0.00450455913284762,-0.0152586643030505,-0.0216567072141399,-0.0238486887587461,-0.0223972169879857,-0.0181706817624835,-0.0122098462375855,-0.00558741726177260,0.000720974159454840,0.00593840384848782,0.00955141668320275,0.0113327722797372,0.0113255078683568,0.00979395431763195,0.00715402352601513,0.00389440724056693,0.000500343769484166,-0.00260870103501410,-0.00512249591113992,-0.00686079086122265,-0.00777252485882118,-0.00791730638070645,-0.00743545387545380,-0.00651246591908960,-0.00534467765861517,-0.00411069959506877,-0.00295189527080732,-0.00196250311844038,-0.00118922643832491,-0.000638033059764221,-0.000285972693276480,-9.66186716768311e-05,4.97857463989629e-05 \
  CONFIG.Coefficient_Fractional_Bits 18 \
  CONFIG.Coefficient_Sets 1 \
  CONFIG.Coefficient_Sign Signed \
  CONFIG.Coefficient_Structure Inferred \
  CONFIG.Coefficient_Width 16 \
  CONFIG.ColumnConfig 1 \
  CONFIG.Data_Fractional_Bits 11 \
  CONFIG.Data_Sign Signed \
  CONFIG.Data_Width 12 \
  CONFIG.Filter_Architecture Systolic_Multiply_Accumulate \
  CONFIG.Output_Rounding_Mode Full_Precision \
  CONFIG.Output_Width 31 \
  CONFIG.Quantization Quantize_Only \
  CONFIG.Sample_Frequency 0.096 \
] [get_bd_cells fir_compiler_0]
create_bd_cell -type module -reference decimation decimation_0
create_bd_cell -type ip -vlnv xilinx.com:ip:xlslice:1.0 xlslice_8
set_property -dict {CONFIG.DIN_FROM 27 CONFIG.DIN_TO 16 CONFIG.DOUT_WIDTH 12} [get_bd_cells xlslice_8]
create_bd_cell -type module -reference inputDecimation inputDecimation_0
create_bd_cell -type ip -vlnv xilinx.com:ip:fir_compiler:7.2 fir_compiler_2
